# EAGLE design tamiya_camrobo_face_dotstar (EAGLE 9.1.3)
CNAME: BotaLab; CREVISION: 1.1; DESIGNER: botamochi6277
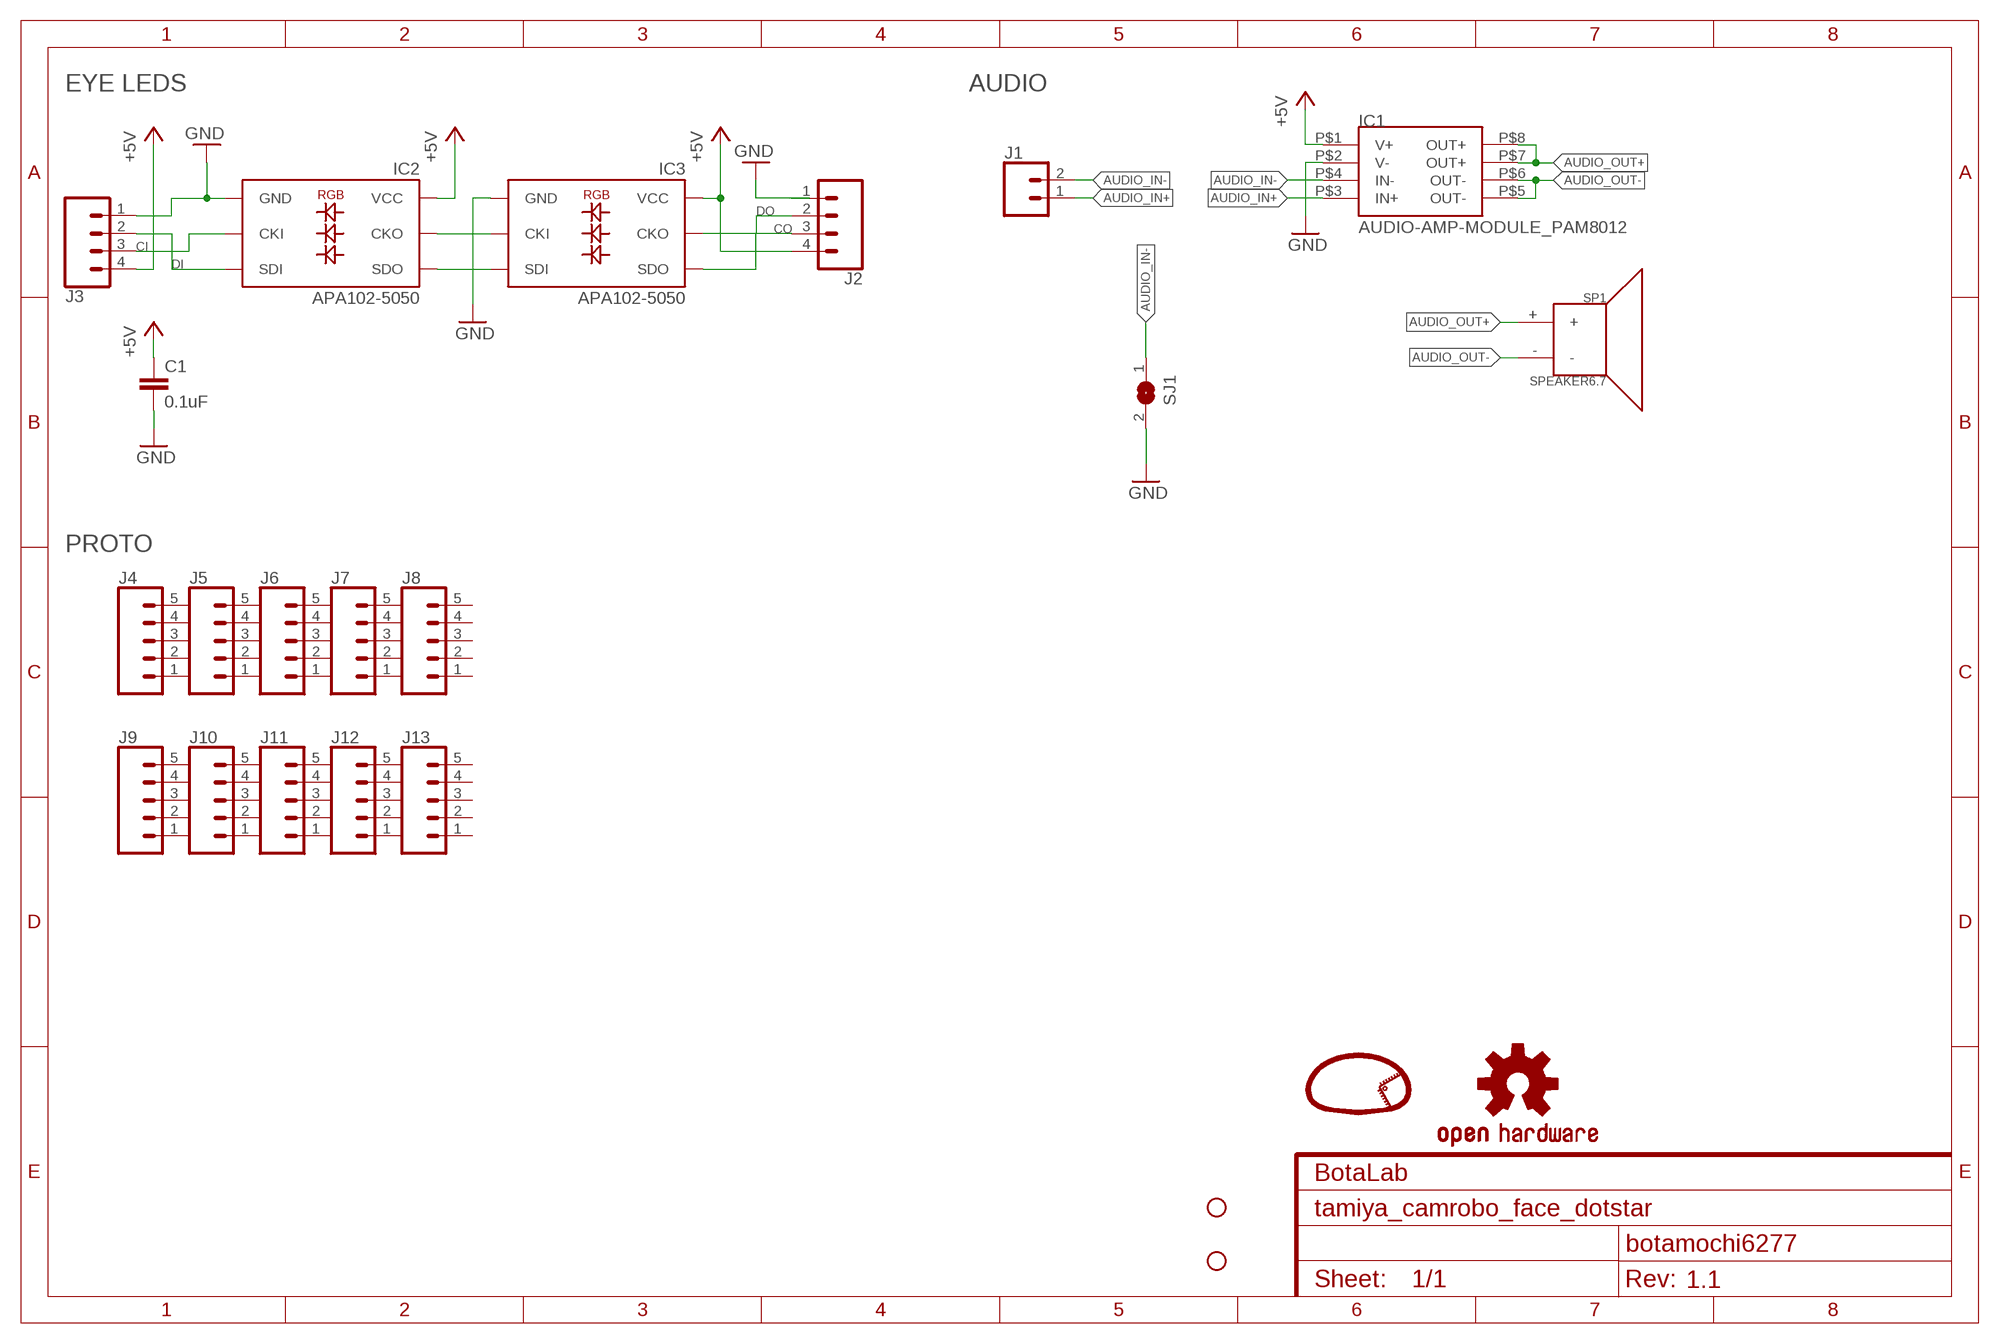
[diagram p0: schematic, sheet 1]

## Parts
C1  0.1uF  C-EUC1608  [C1608]
H1  STAND-OFF  [STAND-OFF]
H2  STAND-OFF  [STAND-OFF]
IC1  AUDIO-AMP-MODULE_PAM8012  [AE-PAM8012]
IC2  APA102-5050  [APA102C-5050]
IC3  APA102-5050  [APA102C-5050]
J1  CONN_02  [1X02]
J2  CONN_04  [1X04]
J3  CONN_04  [1X04]
J4  CONN_05NO_SILK  [1X05_NO_SILK]
J5  CONN_05NO_SILK  [1X05_NO_SILK]
J6  CONN_05NO_SILK  [1X05_NO_SILK]
J7  CONN_05NO_SILK  [1X05_NO_SILK]
J8  CONN_05NO_SILK  [1X05_NO_SILK]
J9  CONN_05NO_SILK  [1X05_NO_SILK]
J10  CONN_05NO_SILK  [1X05_NO_SILK]
J11  CONN_05NO_SILK  [1X05_NO_SILK]
J12  CONN_05NO_SILK  [1X05_NO_SILK]
J13  CONN_05NO_SILK  [1X05_NO_SILK]
LOGO1  LOGO  [LOGO]
LOGO2  OSHW-LOGOS  [OSHW-LOGO-S]
SJ1  SJ  [SJ]
SP1  SPEAKER6.7  [SPEAKER-6.7MM]

## Nets
+5V: C1.1 IC1.P$1(V+) IC2.VCC IC3.VCC J2.4 J3.4
AUDIO_IN+: IC1.P$3(IN+) J1.1
AUDIO_IN-: IC1.P$4(IN-) J1.2 SJ1.1
AUDIO_OUT+: IC1.P$7(OUT+) IC1.P$8(OUT+) SP1.+
AUDIO_OUT-: IC1.P$5(OUT-) IC1.P$6(OUT-) SP1.-
CI: IC2.CKI J3.3
CO: IC3.CKO J2.3
DI: IC2.SDI J3.2
DO: IC3.SDO J2.2
GND: C1.2 IC1.P$2(V-) IC2.GND IC3.GND J2.1 J3.1 SJ1.2
N$1: IC2.SDO IC3.SDI
N$3: IC2.CKO IC3.CKI
Unconnected: J4.1 J4.2 J4.3 J4.4 J4.5 J5.1 J5.2 J5.3 J5.4 J5.5 J6.1 J6.2 J6.3 J6.4 J6.5 J7.1 J7.2 J7.3 J7.4 J7.5 J8.1 J8.2 J8.3 J8.4 J8.5 J9.1 J9.2 J9.3 J9.4 J9.5 J10.1 J10.2 J10.3 J10.4 J10.5 J11.1 J11.2 J11.3 J11.4 J11.5 J12.1 J12.2 J12.3 J12.4 J12.5 J13.1 J13.2 J13.3 J13.4 J13.5

## Notes on the sheet
- EYE LEDS | AUDIO
- PROTO

## Library data of the parts
C1 = rcl:C-EU: CAPACITOR, European symbol; SPICEPREFIX: C
H1 H2 = SparkFun-Hardware:STAND-OFF: Stand Off Drill holes for mechanically mounting via screws, standoffs, etc. Note: Use the keepout ring to avoid running the screw head into surrounding components. Variant Overviews STAND-OFF - Mechanical footprint for a #4 phillips button head screw. STAND-OFF-TIGHT - Mechanical footprint for a #4 phillips button head screw, Example SparkFun Products Screw - Phillips Head (1/4", 4-40, 10 pack) <https://www.sparkfun.com/products/10453> (PRT-10453) Screw - Phillips Head (1/2", 4-40, 10 pack) <https://www.sparkfun.com/products/10452> (PRT-10452) Screw - Phillips Head (3/4", 4-40, 10 pack) <https://www.sparkfun.com/products/10451> (PRT-10451) Screw - Phillips Head (1", 4-40, 10 pack) <https://www.sparkfun.com/products/10450> (PRT-10450)
IC1 = Botamochi-sensors:AUDIO-AMP-MODULE_
IC2 IC3 = Botamochi-sensors:APA102
J1 = SparkFun-Connectors:CONN_02: Multi connection point. Often used as Generic Header-pin footprint for 0.1 inch spaced/style header connections On any of the 0.1 inch spaced packages, you can populate with these: Break Away Headers - Straight <https://www.sparkfun.com/products/116> (PRT-00116) Break Away Male Headers - Right Angle <https://www.sparkfun.com/products/553> (PRT-00553) Female Headers <https://www.sparkfun.com/products/115> (PRT-00115) Break Away Headers - Machine Pin <https://www.sparkfun.com/products/117> (PRT-00117) Break Away Female Headers - Swiss Machine Pin <https://www.sparkfun.com/products/743> (PRT-00743) For SCREWTERMINALS and SPRING TERMINALS visit here: Screw Terimnals on SparkFun.com <https://www.sparkfun.com/search/results?term=Screw+Terminals> (5mm/3.5mm/2.54mm spacing) This device is also useful as a general connection point to wire up your design to another part of your project. Our various solder wires solder well into these plated through hole pads. Hook-Up Wire - Assortment (Stranded, 22 AWG) <https://www.sparkfun.com/products/11375> (PRT-11375) Hook-Up Wire - Assortment (Solid Core, 22 AWG) <https://www.sparkfun.com/products/11367> (PRT-11367) View the entire wire category on our website here <https://www.sparkfun.com/categories/141> Special notes: Molex polarized connector foot print use with: PRT-08233 with associated crimp pins and housings. 2.54_SCREWTERM for use with PRT-10571. 3.5mm Screw Terminal footprints for PRT-08084 5mm Screw Terminal footprints for use with PRT-08432
J2 J3 = SparkFun-Connectors:CONN_04: Multi connection point. Often used as Generic Header-pin footprint for 0.1 inch spaced/style header connections On any of the 0.1 inch spaced packages, you can populate with these: Break Away Headers - Straight <https://www.sparkfun.com/products/116> (PRT-00116) Break Away Male Headers - Right Angle <https://www.sparkfun.com/products/553> (PRT-00553) Female Headers <https://www.sparkfun.com/products/115> (PRT-00115) Break Away Headers - Machine Pin <https://www.sparkfun.com/products/117> (PRT-00117) Break Away Female Headers - Swiss Machine Pin <https://www.sparkfun.com/products/743> (PRT-00743) For SCREWTERMINALS and SPRING TERMINALS visit here: Screw Terimnals on SparkFun.com <https://www.sparkfun.com/search/results?term=Screw+Terminals> (5mm/3.5mm/2.54mm spacing) This device is also useful as a general connection point to wire up your design to another part of your project. Our various solder wires solder well into these plated through hole pads. Hook-Up Wire - Assortment (Stranded, 22 AWG) <https://www.sparkfun.com/products/11375> (PRT-11375) Hook-Up Wire - Assortment (Solid Core, 22 AWG) <https://www.sparkfun.com/products/11367> (PRT-11367) View the entire wire category on our website here <https://www.sparkfun.com/categories/141> Special notes: Molex polarized connector foot print use with SKU : PRT-08231 with associated crimp pins and housings. 1MM SMD Version SKU: PRT-10208; PROD_ID: CONN-09696
J4-J13 = SparkFun-Connectors:CONN_05: Multi connection point. Often used as Generic Header-pin footprint for 0.1 inch spaced/style header connections On any of the 0.1 inch spaced packages, you can populate with these: Break Away Headers - Straight <https://www.sparkfun.com/products/116> (PRT-00116) Break Away Male Headers - Right Angle <https://www.sparkfun.com/products/553> (PRT-00553) Female Headers <https://www.sparkfun.com/products/115> (PRT-00115) Break Away Headers - Machine Pin <https://www.sparkfun.com/products/117> (PRT-00117) Break Away Female Headers - Swiss Machine Pin <https://www.sparkfun.com/products/743> (PRT-00743) For SCREWTERMINALS and SPRING TERMINALS visit here: Screw Terimnals on SparkFun.com <https://www.sparkfun.com/search/results?term=Screw+Terminals> (5mm/3.5mm/2.54mm spacing) This device is also useful as a general connection point to wire up your design to another part of your project. Our various solder wires solder well into these plated through hole pads. Hook-Up Wire - Assortment (Stranded, 22 AWG) <https://www.sparkfun.com/products/11375> (PRT-11375) Hook-Up Wire - Assortment (Solid Core, 22 AWG) <https://www.sparkfun.com/products/11367> (PRT-11367) View the entire wire category on our website here <https://www.sparkfun.com/categories/141> Special notes: Molex polarized connector foot print use with SKU : PRT-08231 with associated crimp pins and housings. 1MM SMD Version SKU: PRT-10208
LOGO1 = botamochi-symbol:LOGO
LOGO2 = SparkFun-Aesthetics:OSHW-LOGO: Open-Source Hardware (OSHW) Logo This logo indicates the piece of hardware it is found on incorporates a OSHW license and/or adheres to the definition of open source hardware found here: http://freedomdefined.org/OSHW
SJ1 = jumper:SJ: SMD solder JUMPER
SP1 = Botamochi-sensors:SPEAKER

## Board
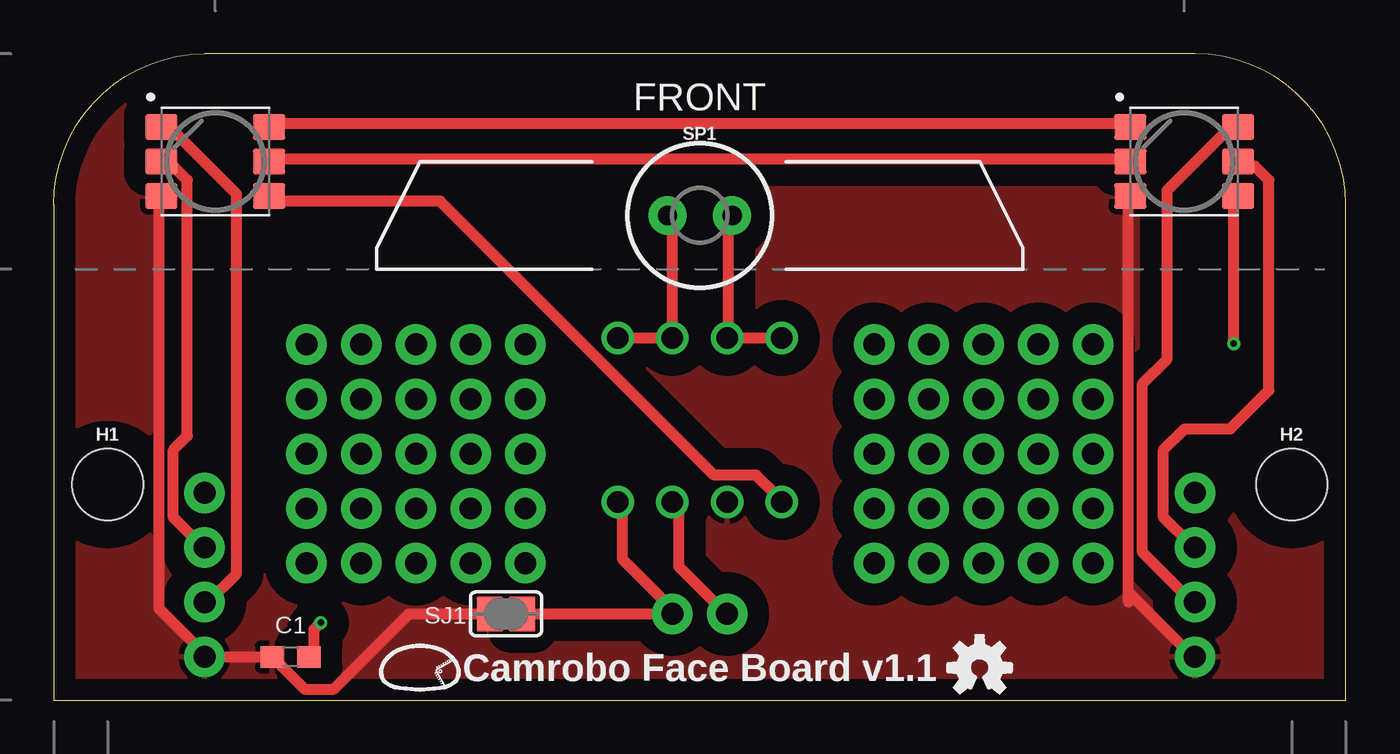
[diagram p1: board, top side]
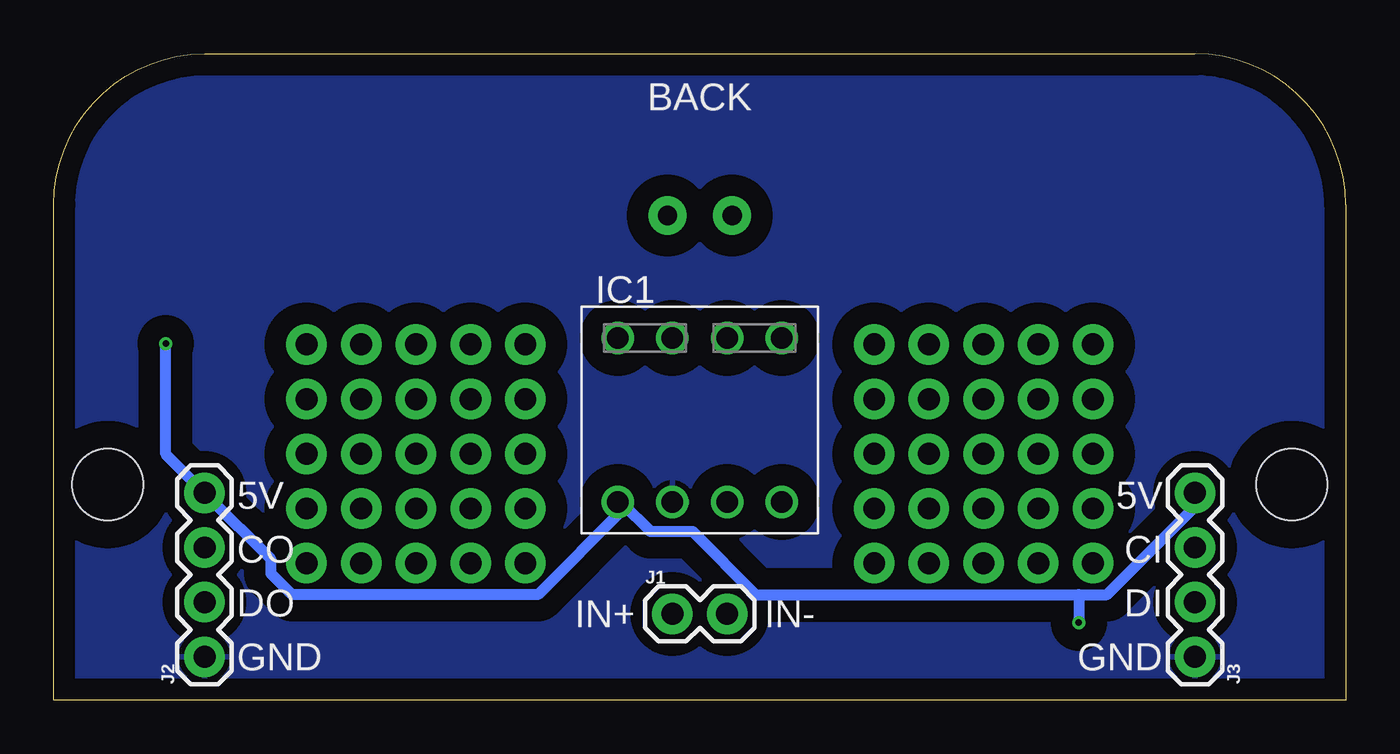
[diagram p2: board, bottom side, seen from below]

Size 60 x 30 mm. Coordinates in mm from the lower left corner, seen from the top.
Outline: 0,0 60,0 60,23 arc90 53,30 7,30 arc90 0,23 0,0
Copper layers (1*16): Top 0.035mm / dielectric 1.5mm / Bottom 0.035mm
Design rules "ssci_SeeedStudio_2layer_DRU_no_angle *": minimum track width 0.5mm, minimum drill 12mil, track to track 6mil, track to pad 6mil, pad to pad 6mil, via to via 6mil, smd to smd 0mil, copper to edge 10mil, drill to drill 10mil, minimum pad ring 10mil, minimum via ring 6mil, stop-mask expansion 2mil, vias tented up to drill 25mil, thermal gap 10mil

### Footprints (pad centres in the part's own frame; a part is rotated, then mirrored left to right if it is on the bottom)
C1608 = smd 1.1 x 1: 1 -0.85,0; 2 0.85,0
STAND-OFF = hole 3.302: 0,0
AE-PAM8012 = drill 1: P$1 -3.81,3.81; P$2 -3.81,1.27; P$3 -3.81,-1.27; P$4 -3.81,-3.81; P$5 3.81,-3.81; P$6 3.81,-1.27; P$7 3.81,1.27; P$8 3.81,3.81
APA102C-5050 = smd 1.5 x 1.2: CKI -2.5,0; CKO 2.5,0; GND -2.5,-1.6; SDI -2.5,1.6; SDO 2.5,1.6; VCC 2.5,-1.6
1X02 = drill 1.016 pad 1.88: 1 0,0; 2 2.54,0
1X04 = drill 1.016 pad 1.88: 1 0,0; 2 2.54,0; 3 5.08,0; 4 7.62,0
1X05_NO_SILK = drill 1.016 pad 1.88: 1 0,0; 2 2.54,0; 3 5.08,0; 4 7.62,0; 5 10.16,0
SJ = smd 1.168 x 1.6: 1 -0.762,0; 2 0.762,0
SPEAKER-6.7MM = drill 0.9 pad 1.778: + 1.5,0; - -1.5,0

### Placement (x,y rotation side)
C1  11,2 180 top
H1  2.5,10 0 top
H2  57.5,10 0 top
IC1  30,13 90 bottom
IC2  7.5,25 0 top
IC3  52.5,25 0 top
J1  31.27,4 0 bottom
J2  53,2 90 bottom
J3  7,2 90 bottom
J4  21.9,6.35 90 top
J5  11.74,6.35 90 top
J6  14.28,6.35 90 top
J7  16.82,6.35 90 top
J8  19.36,6.35 90 top
J9  38.1,6.35 90 top
J10  40.64,6.35 90 top
J11  43.18,6.35 90 top
J12  45.72,6.35 90 top
J13  48.26,6.35 90 top
LOGO1  17,1.5 0 top
LOGO2  43,1.5 0 top
SJ1  21,4 180 top
SP1  30,22.5 0 top

### Tracks (layer width: path | path; a pad name or v marks a point on that pad's centre or on a via)
+5V  (via drill 0.3)
  Top 0.5: IC3.VCC 54.8,23.16 v54.8,16.55 | IC2.VCC 10.11,23.16 17.94,23.16 30.66,10.44 32.62,10.44 33.6,9.46 IC1.P$1 | v12.4,3.59 12.07,3.26 12.07,2.28 C1.1
  Bottom 0.5: 52.84,9.79 J2.4 | 12.4,4.89 27.4,4.89 30.34,7.83 32.29,7.83 33.6,9.13 IC1.P$1 33.6,8.81 37.51,4.89 48.93,4.89 49.91,5.87 49.91,6.52 52.84,9.46 J2.4 | 12.4,4.89 11.09,4.89 7.18,8.81 7.18,9.46 J3.4 | 12.4,4.89 v12.4,3.59 | v54.8,16.55 54.8,11.42 53.17,9.79 J2.4
AUDIO_IN+
  Top 0.5: IC1.P$3 29.03,9.13 29.03,6.2 30.99,4.24 J1.1
AUDIO_IN-
  Top 0.5: 28.71,4.24 26.42,6.52 26.42,9.13 IC1.P$4 | 28.71,4.24 J1.2 | SJ1.1 28.46,4 28.71,4.24
AUDIO_OUT+
  Top 0.5: SP1.+ 31.32,22.18 31.32,16.96 IC1.P$7 IC1.P$8
AUDIO_OUT-
  Top 0.5: 28.71,16.96 28.71,22.18 SP1.- | 28.71,16.96 IC1.P$6 | IC1.P$5 28.55,16.81 28.71,16.96
CI
  Top 0.5: IC2.CKI 5.22,24.79 5.54,24.79 6.2,24.14 6.2,12.27 5.54,11.61 5.54,8.48 6.85,7.18 J3.3
CO
  Top 0.5: IC3.CKO 55.13,24.79 55.78,24.79 56.43,24.14 56.43,14.37 54.65,12.59 52.52,12.59 51.54,11.61 51.54,8.48 52.84,7.18 J2.3
DI
  Top 0.5: IC2.SDI 5.22,26.42 5.54,26.42 8.48,23.49 8.48,5.87 7.18,4.57 J3.2
DO
  Top 0.5: IC3.SDO 54.8,26.42 54.48,26.42 51.71,23.66 51.71,15.83 50.56,14.68 50.56,6.85 52.84,4.57 J2.2
GND
  Top 0.5: IC2.GND 4.89,23.16 4.89,4.24 6.85,2.28 J3.1 C1.2 11.65,0.5 13,0.5 16.5,4 SJ1.2 | 49.91,4.54 49.91,5 | 49.91,5 49.91,23.16 IC3.GND | 49.91,5 52.91,2 J2.1
  pour Bottom (isolate 1): 0,30 0,0 60,0 60,30
  pour Top (isolate 1): 0,30 0,0 60,0 60,30
N$1
  Top 0.5: IC2.SDO 10.11,26.75 49.91,26.75 IC3.SDI
N$3
  Top 0.5: IC2.CKO 10.11,25.12 49.91,25.12 IC3.CKI

### Text on the board
tNames: FRONT | Camrobo Face Board v1.1
bNames: BACK | 5V | 5V | CI | CO | DI | IN- | IN+ | DO | GND | GND